# Altium schematic sheet ELCD.schdoc
size B; SheetNumber: 4; SheetTotal: 8
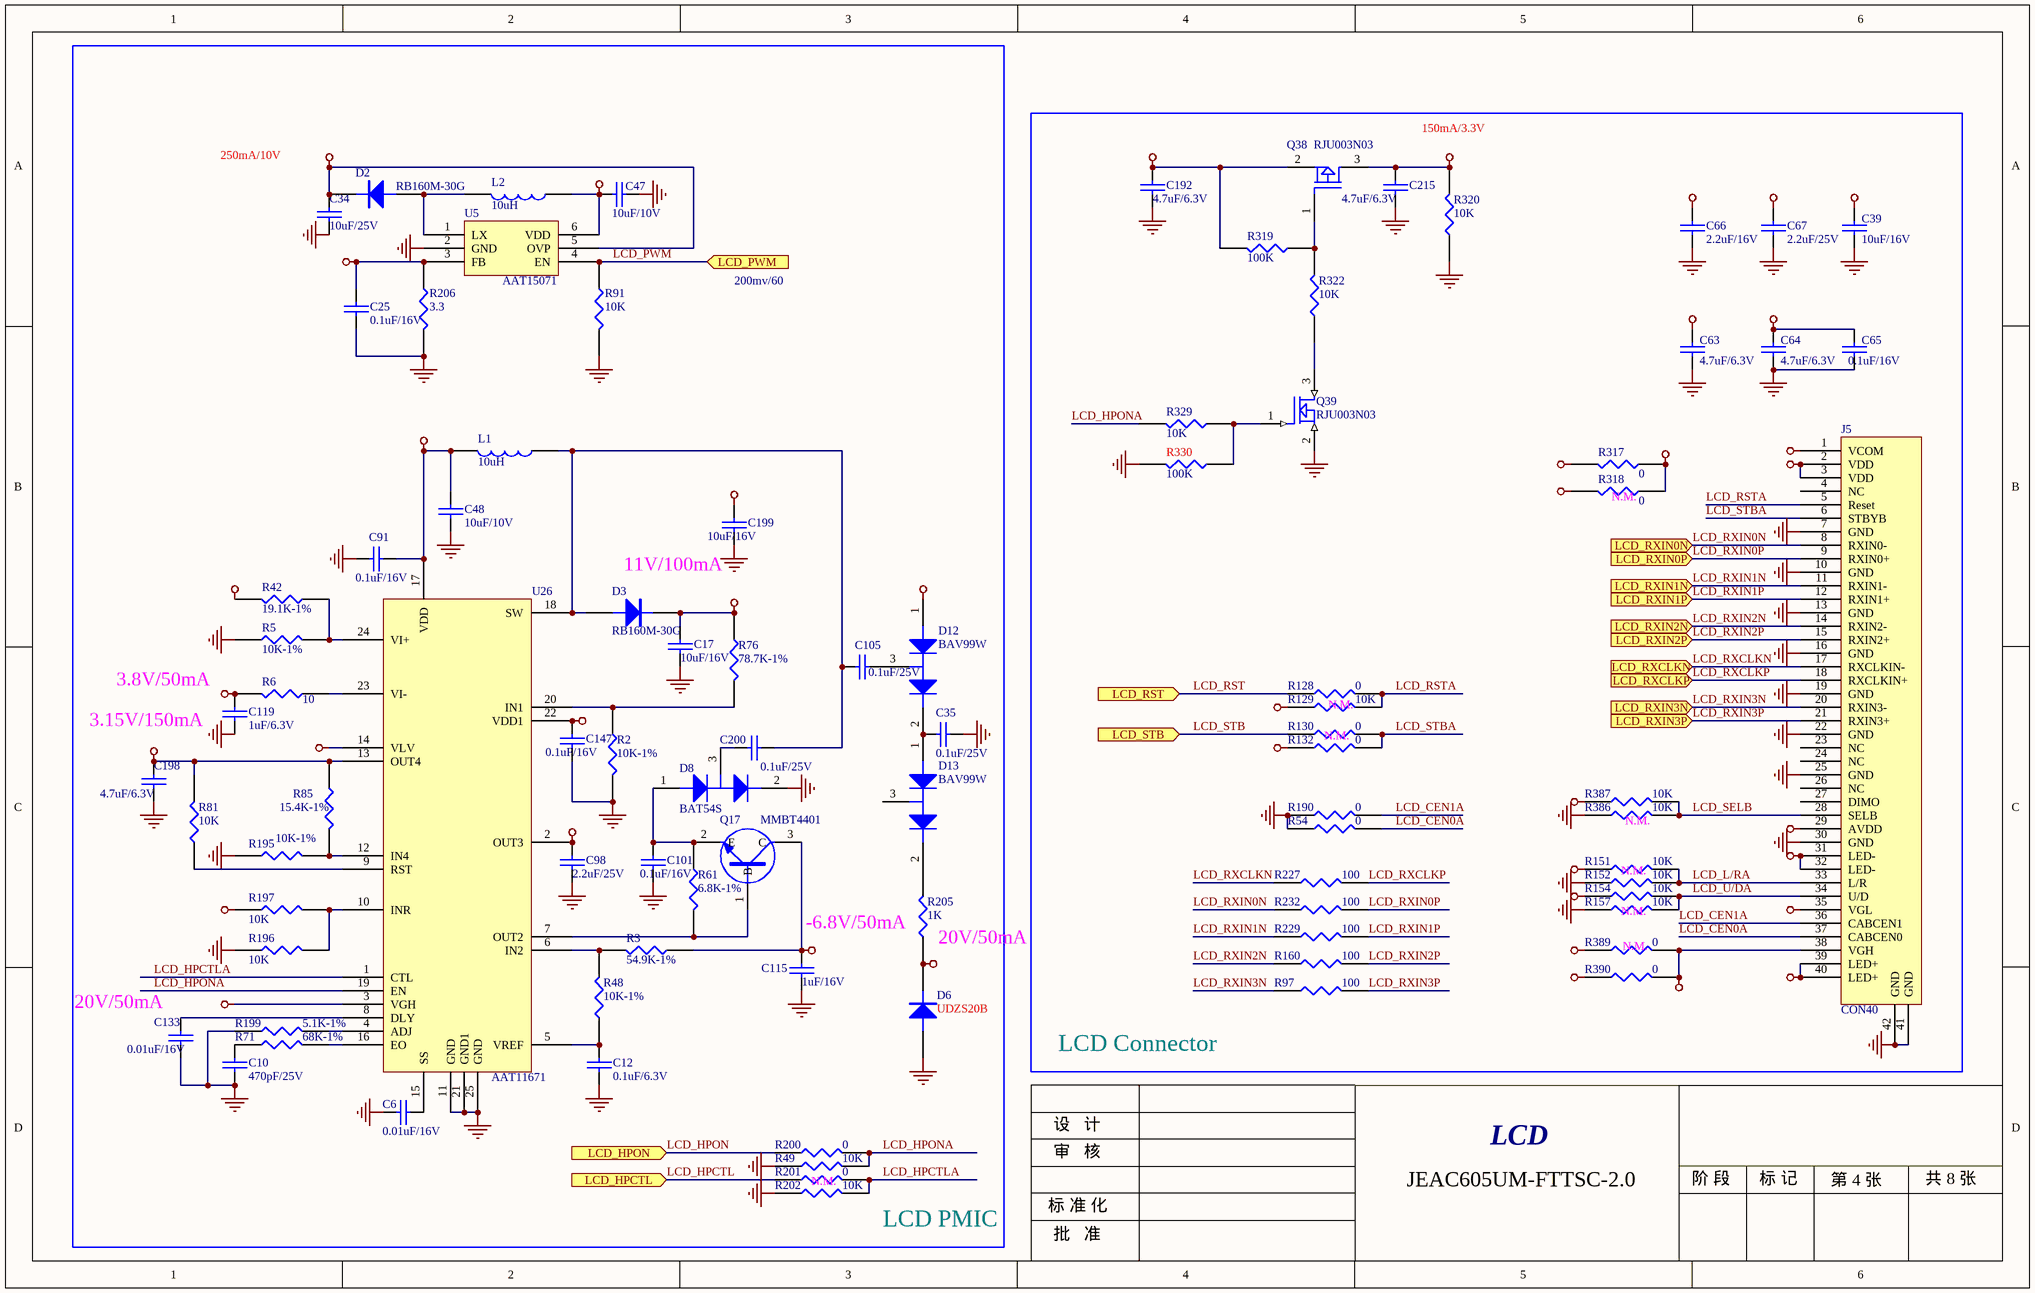
[diagram p0: ELCD.schdoc]

## Parts
C6  0.01uF/16V  [C0402]
C10  470pF/25V  [C0402]
C12  0.1uF/6.3V  [C0402]
C17  10uF/16V  [C1206]
C25  0.1uF/16V  [C0402]
C34  10uF/25V  [C1206]
C35  0.1uF/25V  [C0603]
C39  10uF/16V  [C1206]
C47  10uF/10V  [C0805]
C48  10uF/10V  [C0805]
C63  4.7uF/6.3V  [C0603]
C64  4.7uF/6.3V  [C0603]
C65  0.1uF/16V  [C0402]
C66  2.2uF/16V  [C0805]
C67  2.2uF/25V  [C0805]
C91  0.1uF/16V  [C0402]
C98  0.1uF/16V  [C0805]
C101  2.2uF/25V  [C0402]
C105  0.1uF/25V  [C0603]
C115  1uF/16V  [C0603]
C119  1uF/6.3V  [C0402]
C133  0.01uF/16V  [C0402]
C147  0.1uF/16V  [C0402]
C192  4.7uF/6.3V  [C0603]
C198  4.7uF/6.3V  [C0603]
C199  10uF/16V  [C1206]
C200  0.1uF/25V  [C0603]
C215  4.7uF/6.3V  [C0603]
D2  RB160M-30G  [SOD-123]
D3  RB160M-30G  [SOD-123]
D6  UDZS20B  [UDZS24B]
D8  BAT54S  [SOT-23]
D12  BAV99W  [SOT-23]
D13  BAV99W  [SOT-23]
J5  CON40  [j-con-40-0_5f]
L1  10uH  [l-2-EIA1008]
L2  10uH  [l-2-EIA1008]
Q17  MMBT4401  [SOT-23-NPN]
Q38  RJU003N03  [SOT-23]
Q39  RJU003N03  [SOT-23-NPN]
R2  10K-1%  [R0402]
R3  54.9K-1%  [R0402]
R5  10K-1%  [R0402]
R6  10  [R0402]
R42  19.1K-1%  [R0402]
R48  10K-1%  [R0402]
R49  10K  [R0402]
R54  0  [R0402]
R61  6.8K-1%  [R0402]
R71  68K-1%  [R0402]
R76  78.7K-1%  [R0402]
R81  10K  [R0402]
R85  15.4K-1%  [R0402]
R91  10K  [R0402]
R97  100  [R0402]
R128  0  [R0402]
R129  10K  [R0402]
R130  0  [R0402]
R132  0  [R0402]
R151  10K  [R0402]
R152  10K  [R0402]
R154  10K  [R0402]
R157  10K  [R0402]
R160  100  [R0402]
R190  0  [R0402]
R195  10K-1%  [R0402]
R196  10K  [R0402]
R197  10K  [R0402]
R199  5.1K-1%  [R0402]
R200  0  [R0402]
R201  0  [R0402]
R202  10K  [R0402]
R205  1K  [R0603]
R206  3.3  [R0603]
R227  100  [R0402]
R229  100  [R0402]
R232  100  [R0402]
R317  0  [R0402]
R318  0  [R0402]
R319  100K  [R0402]
R320  10K  [R0402]
R322  10K  [R0402]
R329  10K  [R0402]
R330  100K  [R0402]
R386  10K  [R0402]
R387  10K  [R0402]
R389  0  [R0402]
R390  0  [R0402]
U5  AAT15071  [SOT23-6-0_95]
U26  AAT11671  [U-QFN-24-0_5]

## Blocks framed on the sheet
LCD PMIC: C6 C10 C12 C17 C25 C34 C35 C47 C48 C91 C98 C101 C105 C115 C119 C133 C147 C198-C200 D2 D3 D6 D8 D12 D13 L1 L2 Q17 R2 R3 R5 R6 R42 R48 R49 R61 R71 R76 R81 R85 R91 R195-R197 R199-R202 R205 R206 U5 U26
LCD Connector: C39 C63-C67 C192 C215 J5 Q38 Q39 R54 R97 R128-R130 R132 R151 R152 R154 R157 R160 R190 R227 R229 R232 R317-R320 R322 R329 R330 R386 R387 R389 R390

## Ports
LCD_HPCTL (in), LCD_HPON (in), LCD_PWM (in), LCD_RST (in), LCD_RXCLKN (in), LCD_RXCLKP (in), LCD_RXIN0N (in), LCD_RXIN0P (in), LCD_RXIN1N (in), LCD_RXIN1P (in), LCD_RXIN2N (in), LCD_RXIN2P (in), LCD_RXIN3N (in), LCD_RXIN3P (in), LCD_STB (in)

## Nets
BLED_N: C25.1 J5.31(LED-) J5.32(LED-) R206.1 U5.3(FB)
BLED_P: C34.2 D2.2 J5.39(LED+) J5.40(LED+) U5.5(OVP)
GND: C6.2 C10.1 C12.2 C17.1 C25.2 C34.1 C35.2 C39.2 C47.2 C48.1 C63.2 C64.2 C65.2 C66.1 C67.1 C91.2 C98.1 C101.2 C115.1 C119.1 C133.2 C147.2 C192.2 C198.2 C199.1 C215.1 D6.1 D8.2 J5.7(GND) J5.10(GND) J5.13(GND) J5.16(GND) J5.19(GND) J5.22(GND) J5.25(GND) J5.30(GND) J5.41(GND) J5.42(GND) Q39.2(S) R2.2 R5.1 R49.1 R54.1 R91.2 R152.1 R157.1 R190.1 R195.1 R196.1 R199.1 R202.1 R206.2 R320.1 R330.2 R386.1 U5.2(GND) U26.11(GND) U26.21(GND1) U26.25(GND)
LCD_AVDD: C17.2 C39.1 C147.1 C199.2 D3.2 D12.1 J5.29(AVDD) R42.2 R76.1 U26.22(VDD1)
LCD_VCOM: C63.1 C119.2 J5.1(VCOM) R6.2
LCD_VGH: C67.2 J5.38(VGH) R389.2 R390.2
LCD_VGL: C66.2 C115.2 J5.35(VGL) Q17.3(C) R3.1
V_HS: C47.1 C48.2 C91.1 L1.2 L2.1 U5.6(VDD) U26.14(VLV) U26.17(VDD)
VCC_3V: C192.1 Q38.2(S) R319.2
VCC_LCD: C64.1 C65.1 J5.2(VDD) J5.3(VDD) R129.1 R132.1 R151.1 R154.1 R317.1 R318.1 R387.1
VCC_LCD1: C198.1 R81.2 R85.1 R197.1 R318.2 U26.13(OUT4)
VCC_LCD2: C215.2 Q38.3(D) R317.2 R320.2
VDD_VGH: R390.1 U26.3(VGH)
VOUT3: C98.2 D6.2 R205.1 R389.1 U26.2(OUT3)
LCD_CEN0A: J5.37(CABCEN0) R54.2
LCD_CEN1A: J5.36(CABCEN1) R190.2
LCD_HPCTL: R201.1 ; port LCD_HPCTL
LCD_HPCTLA: R201.2 R202.2 U26.1(CTL)
LCD_HPON: R200.1 ; port LCD_HPON
LCD_HPONA: R49.2 R200.2 R329.2 U26.19(EN)
LCD_L/RA: J5.33(L/R) R151.2 R152.2
LCD_PWM: R91.1 U5.4(EN) ; port LCD_PWM
LCD_RST: R128.1 ; port LCD_RST
LCD_RSTA: J5.5(Reset) R128.2 R129.2
LCD_RXCLKN: J5.17(RXCLKIN-) R227.1 ; port LCD_RXCLKN
LCD_RXCLKP: J5.18(RXCLKIN+) R227.2 ; port LCD_RXCLKP
LCD_RXIN0N: J5.8(RXIN0-) R232.1 ; port LCD_RXIN0N
LCD_RXIN0P: J5.9(RXIN0+) R232.2 ; port LCD_RXIN0P
LCD_RXIN1N: J5.11(RXIN1-) R229.1 ; port LCD_RXIN1N
LCD_RXIN1P: J5.12(RXIN1+) R229.2 ; port LCD_RXIN1P
LCD_RXIN2N: J5.14(RXIN2-) R160.1 ; port LCD_RXIN2N
LCD_RXIN2P: J5.15(RXIN2+) R160.2 ; port LCD_RXIN2P
LCD_RXIN3N: J5.20(RXIN3-) R97.1 ; port LCD_RXIN3N
LCD_RXIN3P: J5.21(RXIN3+) R97.2 ; port LCD_RXIN3P
LCD_SELB: J5.28(SELB) R386.2 R387.2
LCD_STB: R130.1 ; port LCD_STB
LCD_STBA: J5.6(STBYB) R130.2 R132.2
LCD_U/DA: J5.34(U/D) R154.2 R157.2
NetC6_1: C6.1 U26.15(SS)
NetC10_2: C10.2 R71.1
NetC12_1: C12.1 R48.1 U26.5(VREF)
NetC35_1: C35.1 D12.2 D13.1
NetC101_1: C101.1 D8.1 Q17.2(E) R61.1
NetC105_1: C105.1 C200.2 D3.1 L1.1 U26.18(SW)
NetC105_2: C105.2 D12.3
NetC133_1: C133.1 U26.8(DLY)
NetC200_1: C200.1 D8.3
NetD2_1: D2.1 L2.2 U5.1(LX)
NetD13_2: D13.2 R205.2
NetQ17_1: Q17.1(B) R61.2 U26.7(OUT2)
NetQ38_1: Q38.1(G) R319.1 R322.2
NetQ39_1: Q39.1(G) R329.1 R330.1
NetQ39_3: Q39.3(D) R322.1
NetR2_1: R2.1 R76.2 U26.20(IN1)
NetR3_2: R3.2 R48.2 U26.6(IN2)
NetR5_2: R5.2 R42.1 U26.24(VI+)
NetR6_1: R6.1 U26.23(VI-)
NetR71_2: R71.2 U26.16(EO)
NetR81_1: R81.1 U26.9(RST)
NetR85_2: R85.2 R195.2 U26.12(IN4)
NetR196_2: R196.2 R197.2 U26.10(INR)
NetR199_2: R199.2 U26.4(ADJ)

Not connected (* = marked no-connect by the designer): D13 3; J5 4(NC) 23(NC) 24(NC) 26(NC) 27(DIMO)

## Notes on the sheet
- 250mA/10V
- 150mA/3.3V
- 200mv/60
- (near R318) N.M.
- 11V/100mA
- (near C119) 3.8V/50mA
- (near R129) N.M.
- 3.15V/150mA
- N.M.
- (near R386) N.M.
- -6.8V/50mA
- (near R205) 20V/50mA
- (near R157) N.M.
- (near R389) N.M.
- (near C133) 20V/50mA
- 设   计
- 审   核
- LCD
- 标 准 化
- 批   准
- JEAC605UM-FTTSC-2.0
- 阶 段
- 标 记
- 第 4 张
- 共 8 张

## Library data of the parts
C6 C10 C12 C17 C25 C34 C35 C39 C47 C48 C63-C67 C91 C98 C101 C105 C115 C119 C133 C147 C192 C198-C200 C215 = CAP: Capacitor
D2 D3 D6 = DIODE
D8 D12 D13 = MBRS1100
L1 L2 = INDUCTOR1
Q17 = NPN: NPN Transistor
Q38 = SI1021
Q39 = MOSFET N
R2 R3 R5 R6 R42 R48 R49 R54 R61 R71 R76 R81 R85 R91 R97 R128-R130 R132 R151 R152 R154 R157 R160 R190 R195-R197 R199-R202 R205 R206 R227 R229 R232 R317-R320 R322 R329 R330 R386 R387 R389 R390 = RES1